# Altium schematic sheet 邮票孔参考设计.SchDoc: 1234
size A2
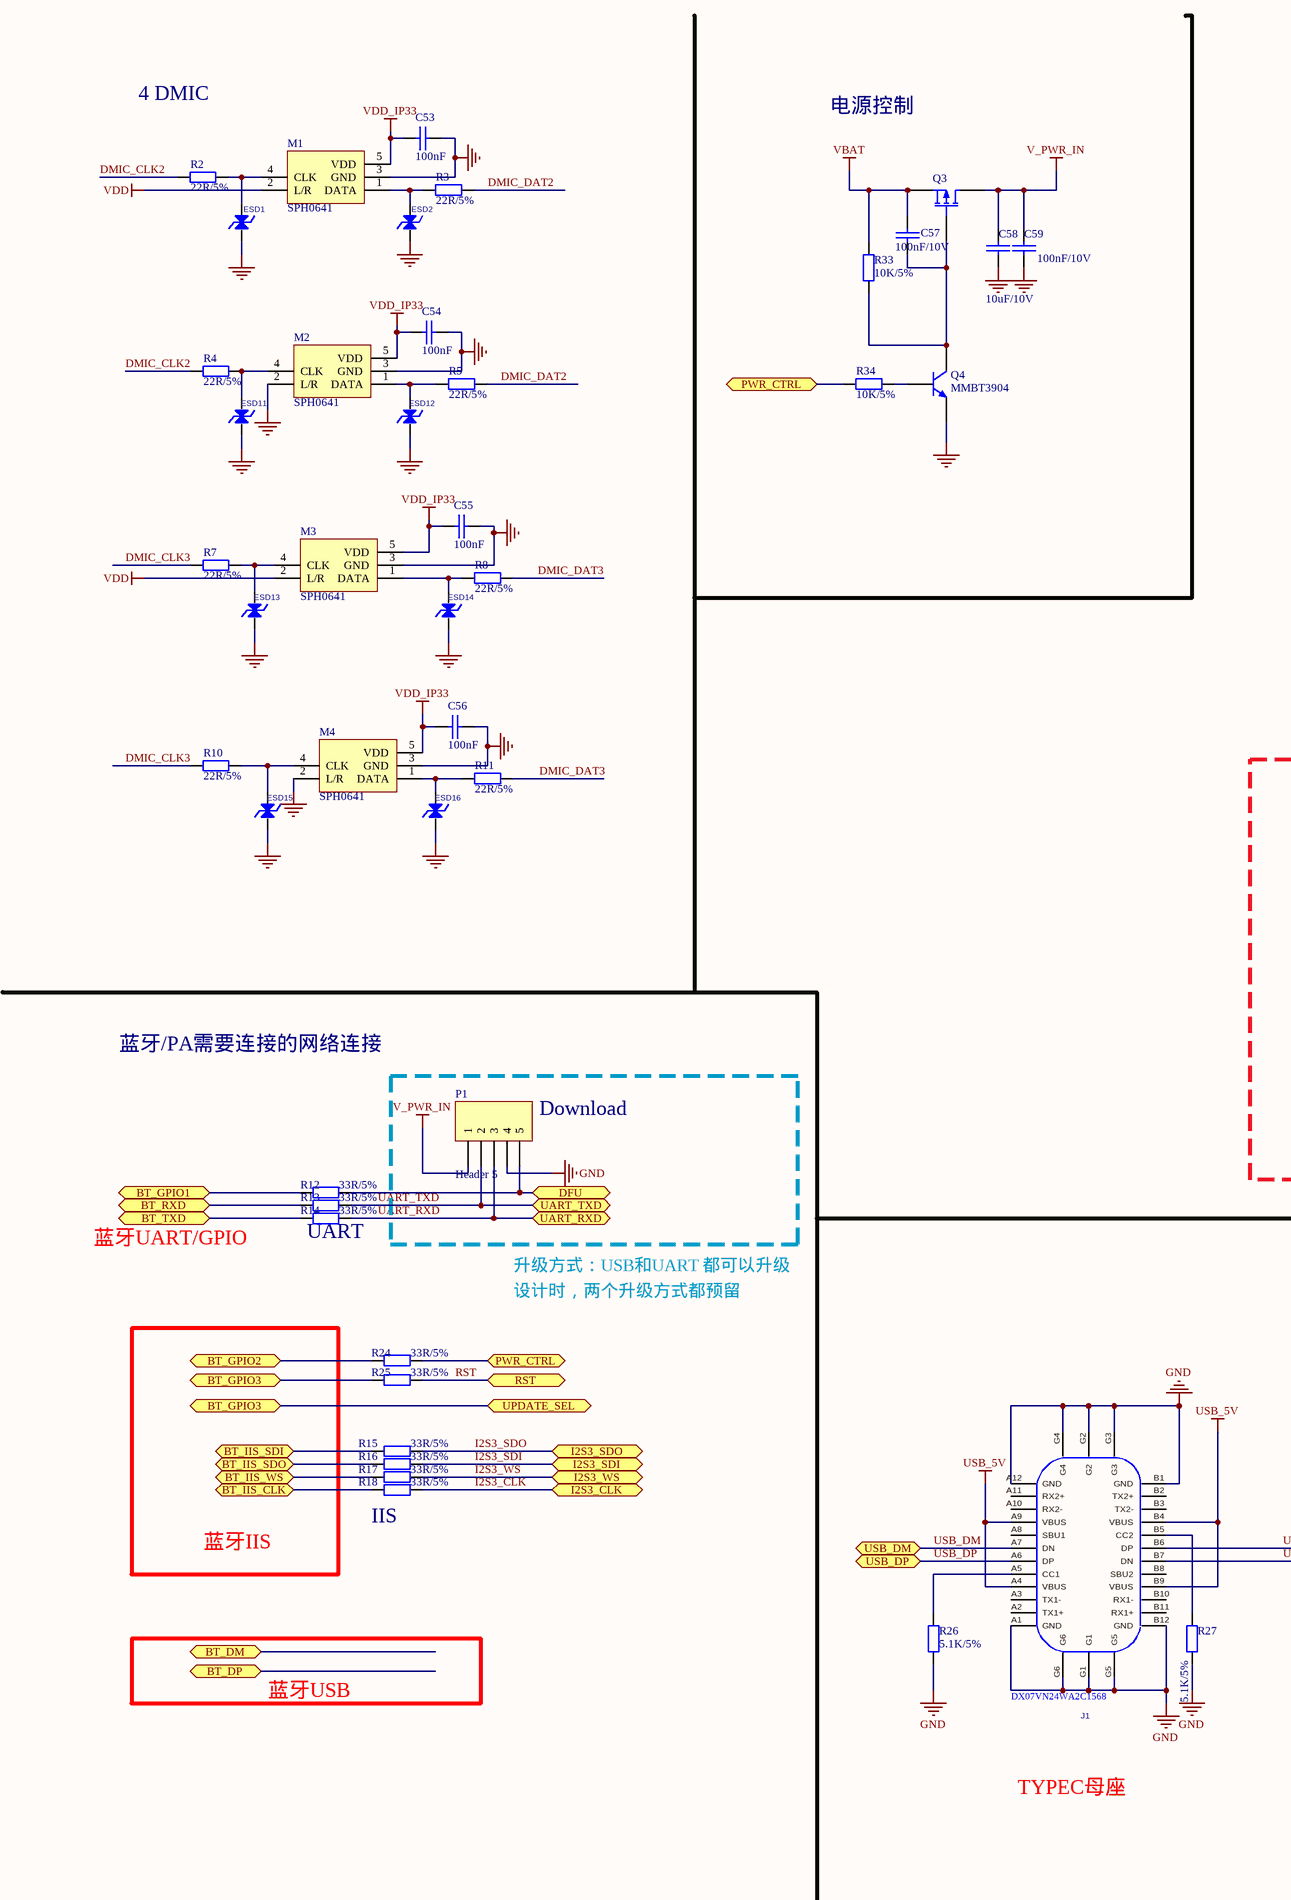
[diagram p0: 邮票孔参考设计.SchDoc, left]
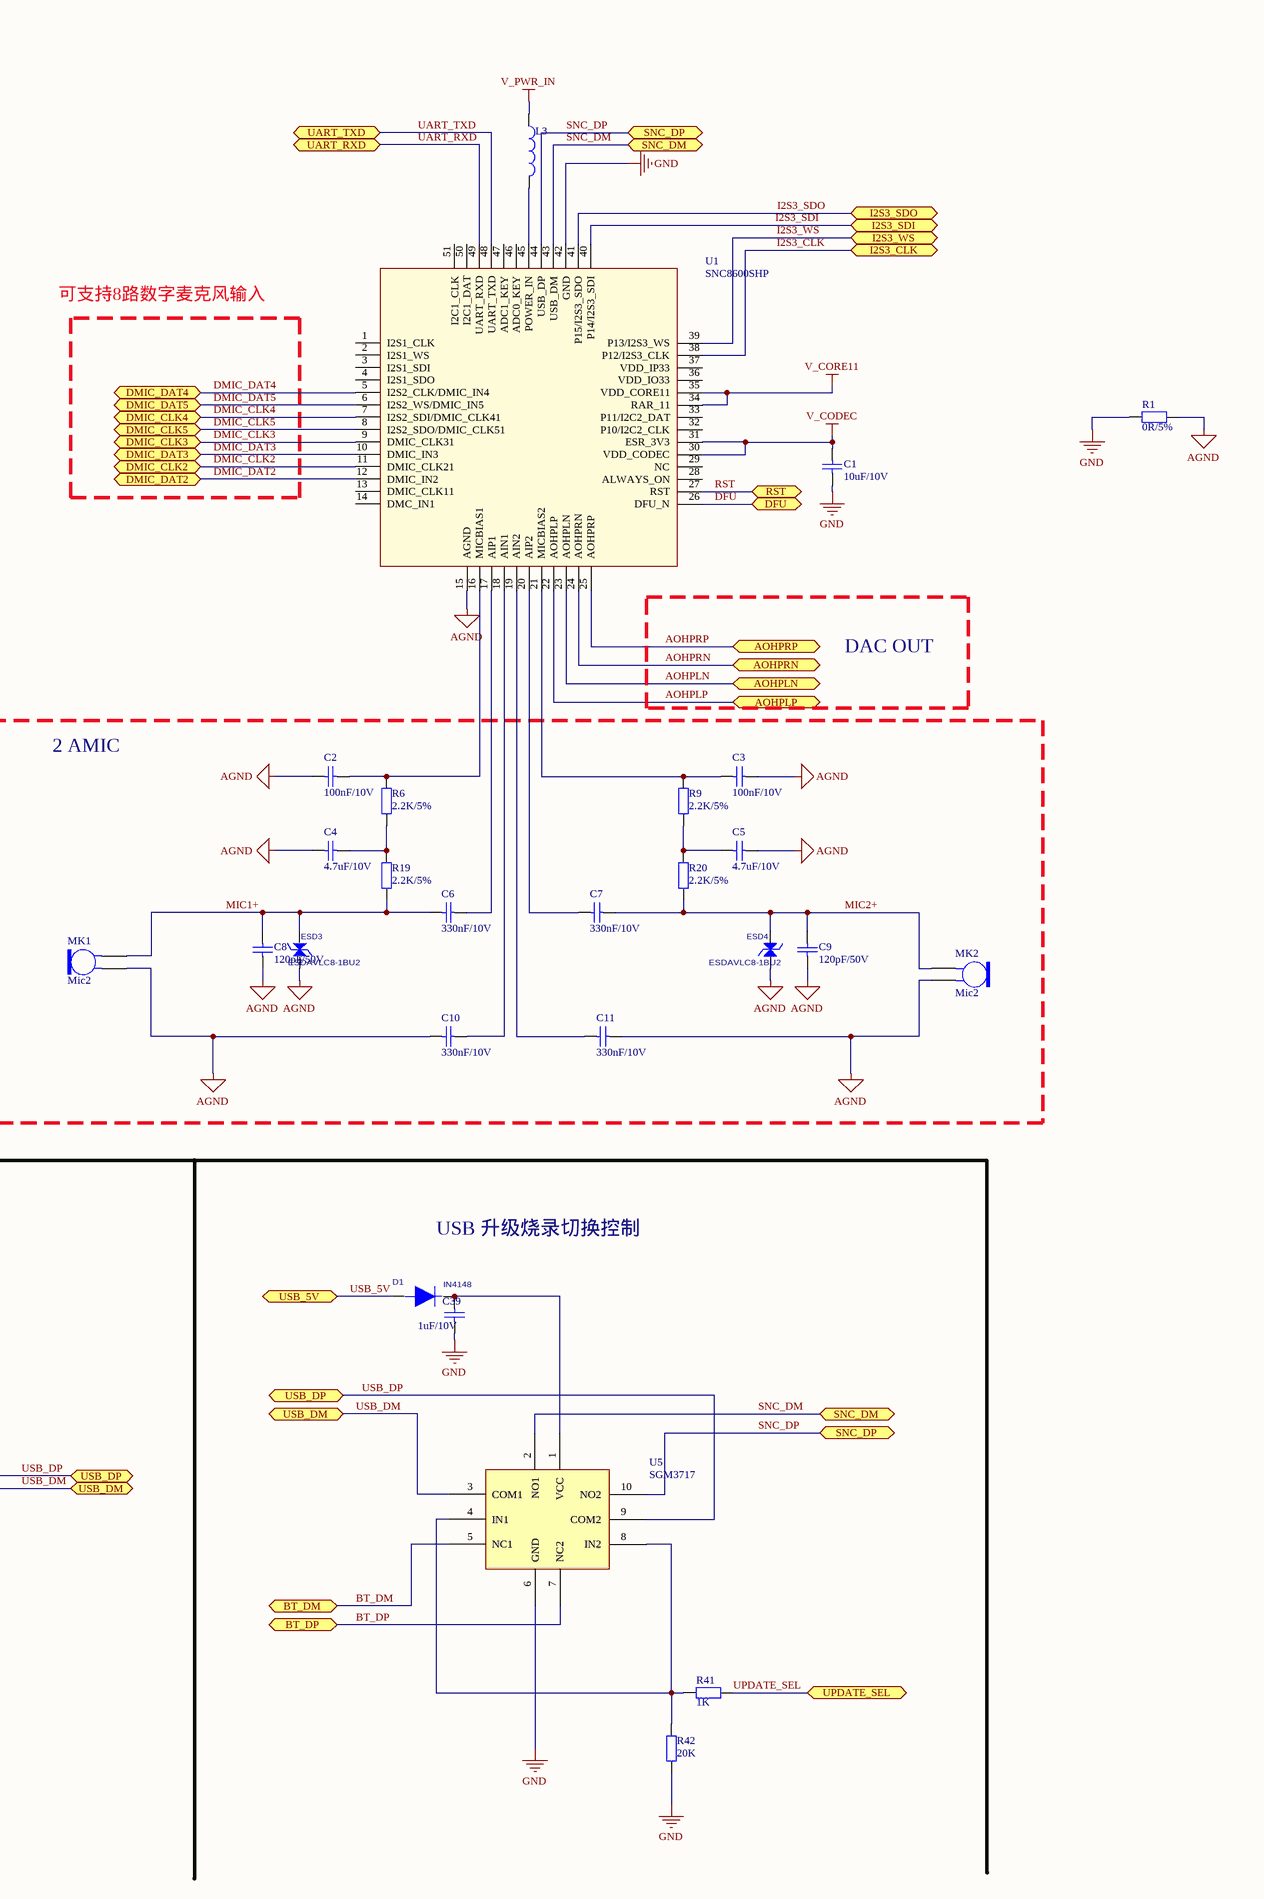
[diagram p1: 邮票孔参考设计.SchDoc, right]

## Parts
C1  10uF/10V  [C0603]
C2  100nF/10V  [C0402]
C3  100nF/10V  [C0402]
C4  4.7uF/10V  [0402]
C5  4.7uF/10V  [0402]
C6  330nF/10V  [C0402]
C7  330nF/10V  [C0402]
C8  120pF/50V  [C0402]
C9  120pF/50V  [C0402]
C10  330nF/10V  [C0402]
C11  330nF/10V  [C0402]
C39  1uF/10V  [C0603]
C53  100nF  [0201]
C54  100nF  [0201]
C55  100nF  [0201]
C56  100nF  [0201]
C57  100nF/10V  [0201]
C58  10uF/10V  [C0402]
C59  100nF/10V  [0201]
D1  value IN4148  [SMD]  (hidden comment: D-IN4148-SMT)
ESD1  (no value)  [0402 DFN]
ESD2  (no value)  [0402 DFN]
ESD3  ESDAVLC8-1BU2  [0402 DFN]
ESD4  ESDAVLC8-1BU2  [0402 DFN]
ESD11  (no value)  [0402 DFN]
ESD12  (no value)  [0402 DFN]
ESD13  (no value)  [0402 DFN]
ESD14  (no value)  [0402 DFN]
ESD15  (no value)  [0402 DFN]
ESD16  (no value)  [0402 DFN]
J1  TYPEC  [USB-TYPEC]  (value not drawn)
L3  (no value)  [R0402]
M1  SPH0641  [SPH_3526]
M2  SPH0641  [SPH_3526]
M3  SPH0641  [SPH_3526]
M4  SPH0641  [SPH_3526]
MK1  Mic2  [PIN2]
MK2  Mic2  [PIN2]
P1  Header 5  [HDR1X5]
Q3  (no value)  [SOT23_3407]
Q4  MMBT3904  [SOT23]
R1  0R/5%  [R0603]
R2  22R/5%  [0201]
R3  22R/5%  [0201]
R4  22R/5%  [0201]
R5  22R/5%  [0201]
R6  2.2K/5%  [R0402]
R7  22R/5%  [0201]
R8  22R/5%  [0201]
R9  2.2K/5%  [R0402]
R10  22R/5%  [0201]
R11  22R/5%  [0201]
R12  33R/5%  [R0603]
R13  33R/5%  [R0603]
R14  33R/5%  [R0603]
R15  33R/5%  [R0603]
R16  33R/5%  [R0603]
R17  33R/5%  [R0603]
R18  33R/5%  [R0603]
R19  2.2K/5%  [R0402]
R20  2.2K/5%  [R0402]
R24  33R/5%  [R0603]
R25  33R/5%  [R0603]
R26  5.1K/5%  [R0603]
R27  5.1K/5%  [R0603]
R33  10K/5%  [0201]
R34  10K/5%  [0201]
R41  1K  [R0603]
R42  20K  [R0603]
U1  SNC8600SHP
U5  SGM3717  [UQFN10]

## Blocks framed on the sheet
2 AMIC: C2-C11 ESD3 ESD4 MK1 MK2 R6 R9 R19 R20
Download: P1

## Ports
AOHPLN, AOHPLP, AOHPRN, AOHPRP, BT_DM, BT_DP, BT_GPIO1, BT_GPIO2, BT_GPIO3, BT_IIS_CLK, BT_IIS_SDI, BT_IIS_SDO, BT_IIS_WS, BT_RXD, BT_TXD, DFU, DMIC_CLK2, DMIC_CLK3, DMIC_CLK4, DMIC_CLK5, DMIC_DAT2, DMIC_DAT3, DMIC_DAT4, DMIC_DAT5, I2S3_CLK, I2S3_SDI, I2S3_SDO, I2S3_WS, PWR_CTRL, RST, SNC_DM, SNC_DP, UART_RXD, UART_TXD, UPDATE_SEL, USB_5V, USB_DM, USB_DP

## Nets
AGND: C2.2 C3.2 C4.2 C5.2 C8.2 C9.2 C10.1 C11.1 ESD3.2 ESD4.2 MK1.1 MK2.2 R1.1 U1.15(AGND)
GND: C1.1 C39.1 C53.1 C54.1 C55.1 C56.1 C58.1 C59.1 ESD1.2 ESD2.2 ESD11.2 ESD12.2 ESD13.2 ESD14.2 ESD15.2 ESD16.2 J1.A1(GND) J1.A12(GND) J1.B1(GND) J1.B12(GND) J1.G1 J1.G2 J1.G3 J1.G4 J1.G5 J1.G6 M1.3(GND) M2.2(L/R) M2.3(GND) M3.3(GND) M4.2(L/R) M4.3(GND) P1.4 Q4.2(E) R1.2 R26.2 R27.2 R42.2 U1.42(GND) U5.6(GND)
USB_5V: D1.1 J1.A4(VBUS) J1.A9(VBUS) J1.B4(VBUS) J1.B9(VBUS) ; port USB_5V
V_CODEC: C1.2 U1.30(VDD_CODEC) U1.31(ESR_3V3)
V_CORE11: U1.34(RAR_11) U1.35(VDD_CORE11)
V_PWR_IN: C58.2 C59.2 L3.1 P1.1 Q3.1(D)
VBAT: C57.2 Q3.3(S) R33.1
VDD: M1.2(L/R) M3.2(L/R)
VDD_IP33: C53.2 C54.2 C55.2 C56.2 M1.5(VDD) M2.5(VDD) M3.5(VDD) M4.5(VDD)
AOHPLN: U1.23(AOHPLN) ; port AOHPLN
AOHPLP: U1.22(AOHPLP) ; port AOHPLP
AOHPRN: U1.24(AOHPRN) ; port AOHPRN
AOHPRP: U1.25(AOHPRP) ; port AOHPRP
BT_DM: U5.5(NC1) ; port BT_DM
BT_DP: U5.7(NC2) ; port BT_DP
BT_GPIO1: R12.1 ; port BT_GPIO1
BT_GPIO2: R24.1 ; port BT_GPIO2
BT_IIS_CLK: R18.1 ; port BT_IIS_CLK
BT_IIS_SDI: R15.1 ; port BT_IIS_SDI
BT_IIS_SDO: R16.1 ; port BT_IIS_SDO
BT_IIS_WS: R17.1 ; port BT_IIS_WS
BT_RXD: R13.1 ; port BT_RXD
BT_TXD: R14.1 ; port BT_TXD
DFU: P1.5 R12.2 U1.26(DFU_N) ; port DFU
DMIC_CLK2: R2.1 R4.1 U1.11(DMIC_CLK21) ; port DMIC_CLK2
DMIC_CLK3: R7.1 R10.1 U1.9(DMIC_CLK31) ; port DMIC_CLK3
DMIC_CLK4: U1.7(I2S2_SDI/DMIC_CLK41) ; port DMIC_CLK4
DMIC_CLK5: U1.8(I2S2_SDO/DMIC_CLK51) ; port DMIC_CLK5
DMIC_DAT2: R3.2 R5.2 U1.12(DMIC_IN2) ; port DMIC_DAT2
DMIC_DAT3: R8.2 R11.2 U1.10(DMIC_IN3) ; port DMIC_DAT3
DMIC_DAT4: U1.5(I2S2_CLK/DMIC_IN4) ; port DMIC_DAT4
DMIC_DAT5: U1.6(I2S2_WS/DMIC_IN5) ; port DMIC_DAT5
I2S3_CLK: R18.2 U1.38(P12/I2S3_CLK) ; port I2S3_CLK
I2S3_SDI: R16.2 U1.40(P14/I2S3_SDI) ; port I2S3_SDI
I2S3_SDO: R15.2 U1.41(P15/I2S3_SDO) ; port I2S3_SDO
I2S3_WS: R17.2 U1.39(P13/I2S3_WS) ; port I2S3_WS
MIC1+: C6.1 C8.1 ESD3.1 MK1.2 R19.2
MIC2+: C7.1 C9.1 ESD4.1 MK2.1 R20.2
PWR_CTRL: R24.2 R34.1 ; port PWR_CTRL
RST: R25.2 U1.27(RST) ; port RST
SNC_DM: U1.43(USB_DM) U5.2(NO1) ; port SNC_DM
SNC_DP: U1.44(USB_DP) U5.10(NO2) ; port SNC_DP
UART_RXD: P1.3 R14.2 U1.49(UART_RXD) ; port UART_RXD
UART_TXD: P1.2 R13.2 U1.48(UART_TXD) ; port UART_TXD
UPDATE_SEL: R25.1 R41.1 ; port BT_GPIO3, port UPDATE_SEL
USB_DM: J1.A7(DN) J1.B7(DN) U5.3(COM1) ; port USB_DM
USB_DP: J1.A6(DP) J1.B6(DP) U5.9(COM2) ; port USB_DP
NetC2_1: C2.1 R6.1 U1.16(MICBIAS1)
NetC3_1: C3.1 R9.1 U1.21(MICBIAS2)
NetC4_1: C4.1 R6.2 R19.1
NetC5_1: C5.1 R9.2 R20.1
NetC6_2: C6.2 U1.17(AIP1)
NetC7_2: C7.2 U1.20(AIP2)
NetC10_2: C10.2 U1.18(AIN1)
NetC11_2: C11.2 U1.19(AIN2)
NetC39_2: C39.2 D1.2 U5.1(VCC)
NetC57_1: C57.1 Q3.2(G) Q4.3(C) R33.2
NetESD1_1: ESD1.1 M1.4(CLK) R2.2
NetESD2_1: ESD2.1 M1.1(DATA) R3.1
NetESD11_1: ESD11.1 M2.4(CLK) R4.2
NetESD12_1: ESD12.1 M2.1(DATA) R5.1
NetESD13_1: ESD13.1 M3.4(CLK) R7.2
NetESD14_1: ESD14.1 M3.1(DATA) R8.1
NetESD15_1: ESD15.1 M4.4(CLK) R10.2
NetESD16_1: ESD16.1 M4.1(DATA) R11.1
NetJ1_A5: J1.A5(CC1) R26.1
NetJ1_B5: J1.B5(CC2) R27.1
NetL3_2: L3.2 U1.45(POWER_IN)
NetQ4_1: Q4.1(B) R34.2
NetR41_2: R41.2 R42.1 U5.4(IN1) U5.8(IN2)

Not connected (* = marked no-connect by the designer): J1 A2(TX1+) A3(TX1-) A8(SBU1) A10(RX2-) A11(RX2+) B2(TX2+) B3(TX2-) B8(SBU2) B10(RX1-) B11(RX1+); U1 1(I2S1_CLK) 2(I2S1_WS) 3(I2S1_SDI) 4(I2S1_SDO) 13(DMIC_CLK11) 14(DMC_IN1) 28(ALWAYS_ON) 29(NC) 32(P10/I2C2_CLK) 33(P11/I2C2_DAT) 36(VDD_IO33) 37(VDD_IP33) 46(ADC0_KEY) 47(ADC1_KEY) 50(I2C1_DAT) 51(I2C1_CLK)

## Notes on the sheet
- 4 DMIC
- 电源控制
- 可支持8路数字麦克风输入
- DAC OUT
- 蓝牙/PA需要连接的网络连接
- 蓝牙UART/GPIO
- (near R14) UART
- 升级方式：USB和UART 都可以升级
- 设计时，两个升级方式都预留
- USB 升级烧录切换控制
- 蓝牙IIS
- (near R18) IIS
- 蓝牙USB
- (near J1) DX07VN24WA2C1568
- TYPEC母座

## Library data of the parts
C1-C11 C39 = Cap Semi: Capacitor (Semiconductor SIM Model); Value: 100pF; Published: 8-Jun-2000; LatestRevisionDate: 29-May-2009; LatestRevisionNote: IPC-7351 Footprint Added.; PackageReference: C1206; Publisher: Altium Limited; PackageDescription: Chip Capacitor
C53-C56 = CAP-0201: Capacitor
C57 = CAP: Capacitor; Comment_1: 30pF
C58 C59 = 普通电容: Capacitor
ESD1-ESD4 ESD11-ESD16 = ESD: Sim.Analog.Order: Model$; PCB DECAL: 0402
J1 = TYPEC: PCB DECAL: DX07VN24WA2
L3 = Inductor: Code_IEC: 1005; Value: 10mH; Published: 8-Jun-2000; LatestRevisionDate: 29-May-2009; LatestRevisionNote: IPC-7351 Footprint Added.; PackageReference: 0402-A; Publisher: Altium Limited; PackageDescription: Chip Inductor; Code_JEITA: 0402
M1-M4 = SPH0641: MEMS MICPHONE; Published: 8-Jun-2000; LatestRevisionDate: 29-May-2009; LatestRevisionNote: IPC-7351 Footprint Added.; PackageVersion: Mar-2002; PackageReference: SOT403-1; Publisher: Altium Limited; PackageDescription: 16-Pin Thin Small Outline Package 0.65 mm Pitch; Code_JEDEC: MO-153
MK1 MK2 = Mic2: Microphone; Published: 24-Mar-1999; LatestRevisionDate: 17-Jul-2002; LatestRevisionNote: Re-released for DXP Platform.; PackageReference: PIN2; Publisher: Altium Limited
P1 = Header 5: Header, 5-Pin; LatestRevisionDate: 17-Jul-2002; LatestRevisionNote: Re-released for DXP Platform.; Publisher: Altium Limited
Q3 = MOSFET-P: P-Channel MOSFET; Published: 8-Jun-2000; LatestRevisionDate: 17-Jul-2002; LatestRevisionNote: Re-released for DXP Platform.; PackageVersion: 1995/1996; PackageReference: E3; Publisher: Altium Limited; PackageDescription: TO, Flat Index; 3 In-Line, Axial Leads; Body Dia. 4.6mm; Lead Dia. 0.5 mm (max)
Q4 = 2N3904: NPN General Purpose Amplifier; Published: 8-Jun-2000; LatestRevisionDate: 15-Jan-2003; LatestRevisionNote: PCB Footprint 'BCY-W3/D4.7' replaced; DatasheetVersion: 1997; PackageVersion: Sep-1998; PackageReference: TO-92A; Publisher: Altium Limited; PackageDescription: TO, Flat Index; 3 In-Line, Axial Leads; Body Dia. 4.5mm; Leads 0.51 x 0.48 mm (max); ComponentLink1Description: Manufacturer Link; ComponentLink1URL: http://www.fairchildsemi.com/; ComponentLink2Description: Datasheet; ComponentLink2URL: http://www.fairchildsemi.com/ds/2N%2F2N3904.pdf
R1-R20 R24-R27 R33 R34 R41 R42 = Res2: Resistor; Value: 1M; Published: 8-Jun-2000; LatestRevisionDate: 17-Jul-2002; LatestRevisionNote: Re-released for DXP Platform.; PackageReference: AXIAL-0.4; Publisher: Altium Limited; PackageDescription: Axial Device, Thru-Hole; 2 Leads; 0.4 in Pin Spacing
U5 = NLAS2750
D1 = D-IN4148-SMT: PCB DECAL: SMD